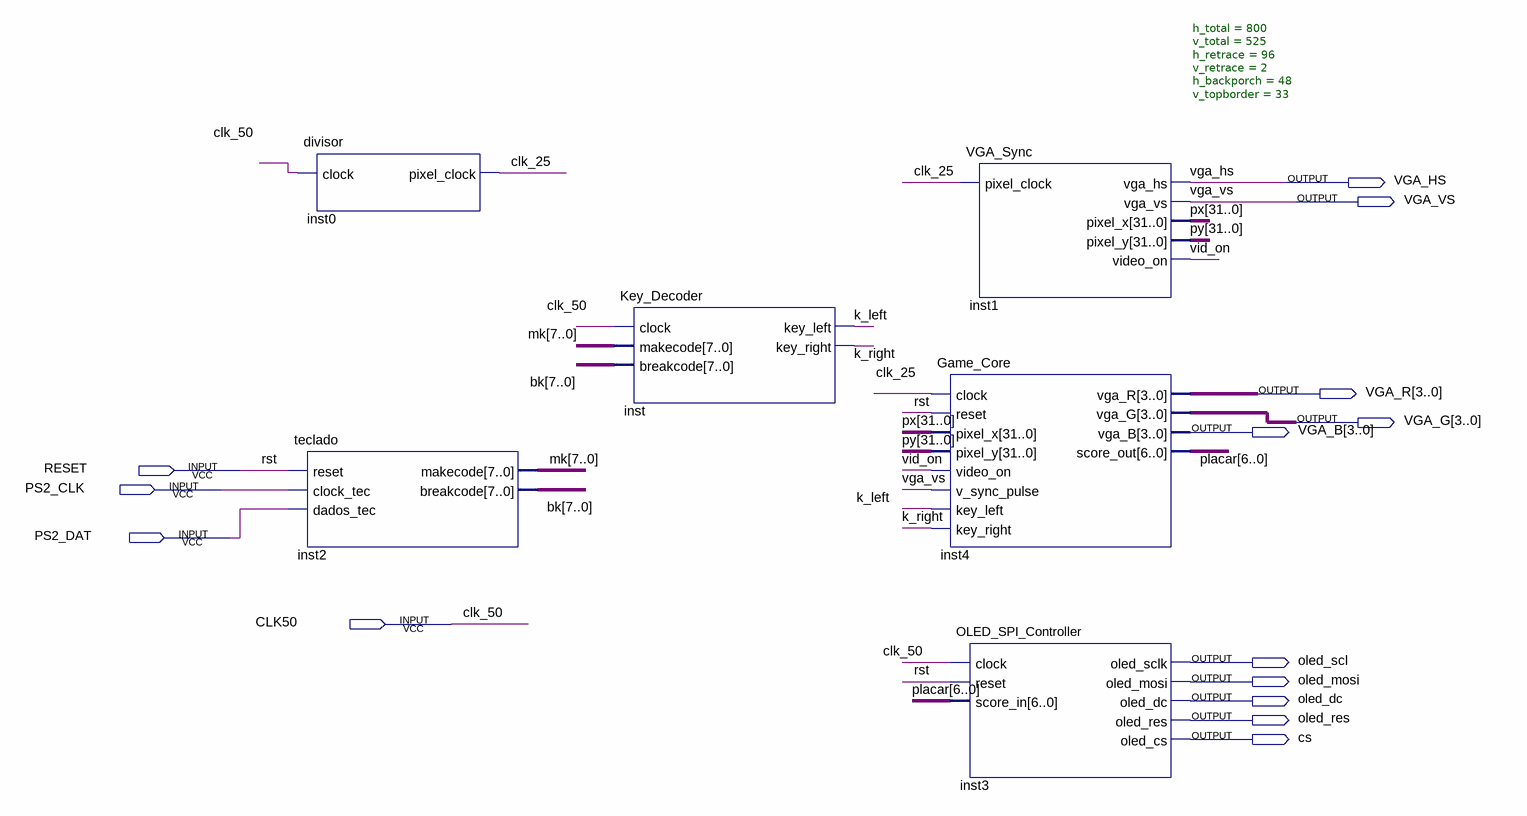
[diagram p0: schematic sheet]
// Quartus schematic Breakout_Top.bdf as structural Verilog: 6 symbols, 14 pins
module Breakout_Top (
  input  RESET,
  input  PS2_CLK,
  input  PS2_DAT,
  input  CLK50,
  output VGA_HS,
  output VGA_VS,
  output [3:0] VGA_R,
  output [3:0] VGA_G,
  output [3:0] VGA_B,
  output oled_scl,
  output oled_mosi,
  output oled_dc,
  output oled_res,
  output cs
);

  wire clk_25, k_left, k_right, vid_on;
  wire [6:0] placar;
  wire [7:0] bk, mk;
  wire [31:0] px, py;

  divisor inst0 (.clock(CLK50), .pixel_clock(clk_25));
  teclado inst2 (.reset(RESET), .clock_tec(PS2_CLK), .dados_tec(PS2_DAT), .makecode(mk), .breakcode(bk));
  Key_Decoder inst (.clock(CLK50), .makecode(mk), .breakcode(bk), .key_left(k_left), .key_right(k_right));
  Game_Core inst4 (
    .clock(clk_25), .reset(RESET), .pixel_x(px), .pixel_y(py), .video_on(vid_on), .v_sync_pulse(VGA_VS),
    .key_left(k_left), .key_right(k_right), .vga_R(VGA_R), .vga_G(VGA_G), .vga_B(VGA_B), .score_out(placar));
  OLED_SPI_Controller inst3 (
    .clock(CLK50), .reset(RESET), .score_in(placar), .oled_sclk(oled_scl), .oled_mosi(oled_mosi),
    .oled_dc(oled_dc), .oled_res(oled_res), .oled_cs(cs));
  VGA_Sync #(.h_total(800), .v_total(525), .h_retrace(96), .v_retrace(2), .h_backporch(48), .v_topborder(33)) inst1 (
    .pixel_clock(clk_25), .vga_hs(VGA_HS), .vga_vs(VGA_VS), .pixel_x(px), .pixel_y(py), .video_on(vid_on));

  // Other names for the same wires on the sheet: clk_50 = CLK50; rst = RESET
endmodule
